# EasyEDA Pro project Controller Board DS-PI.epro, board PCB1
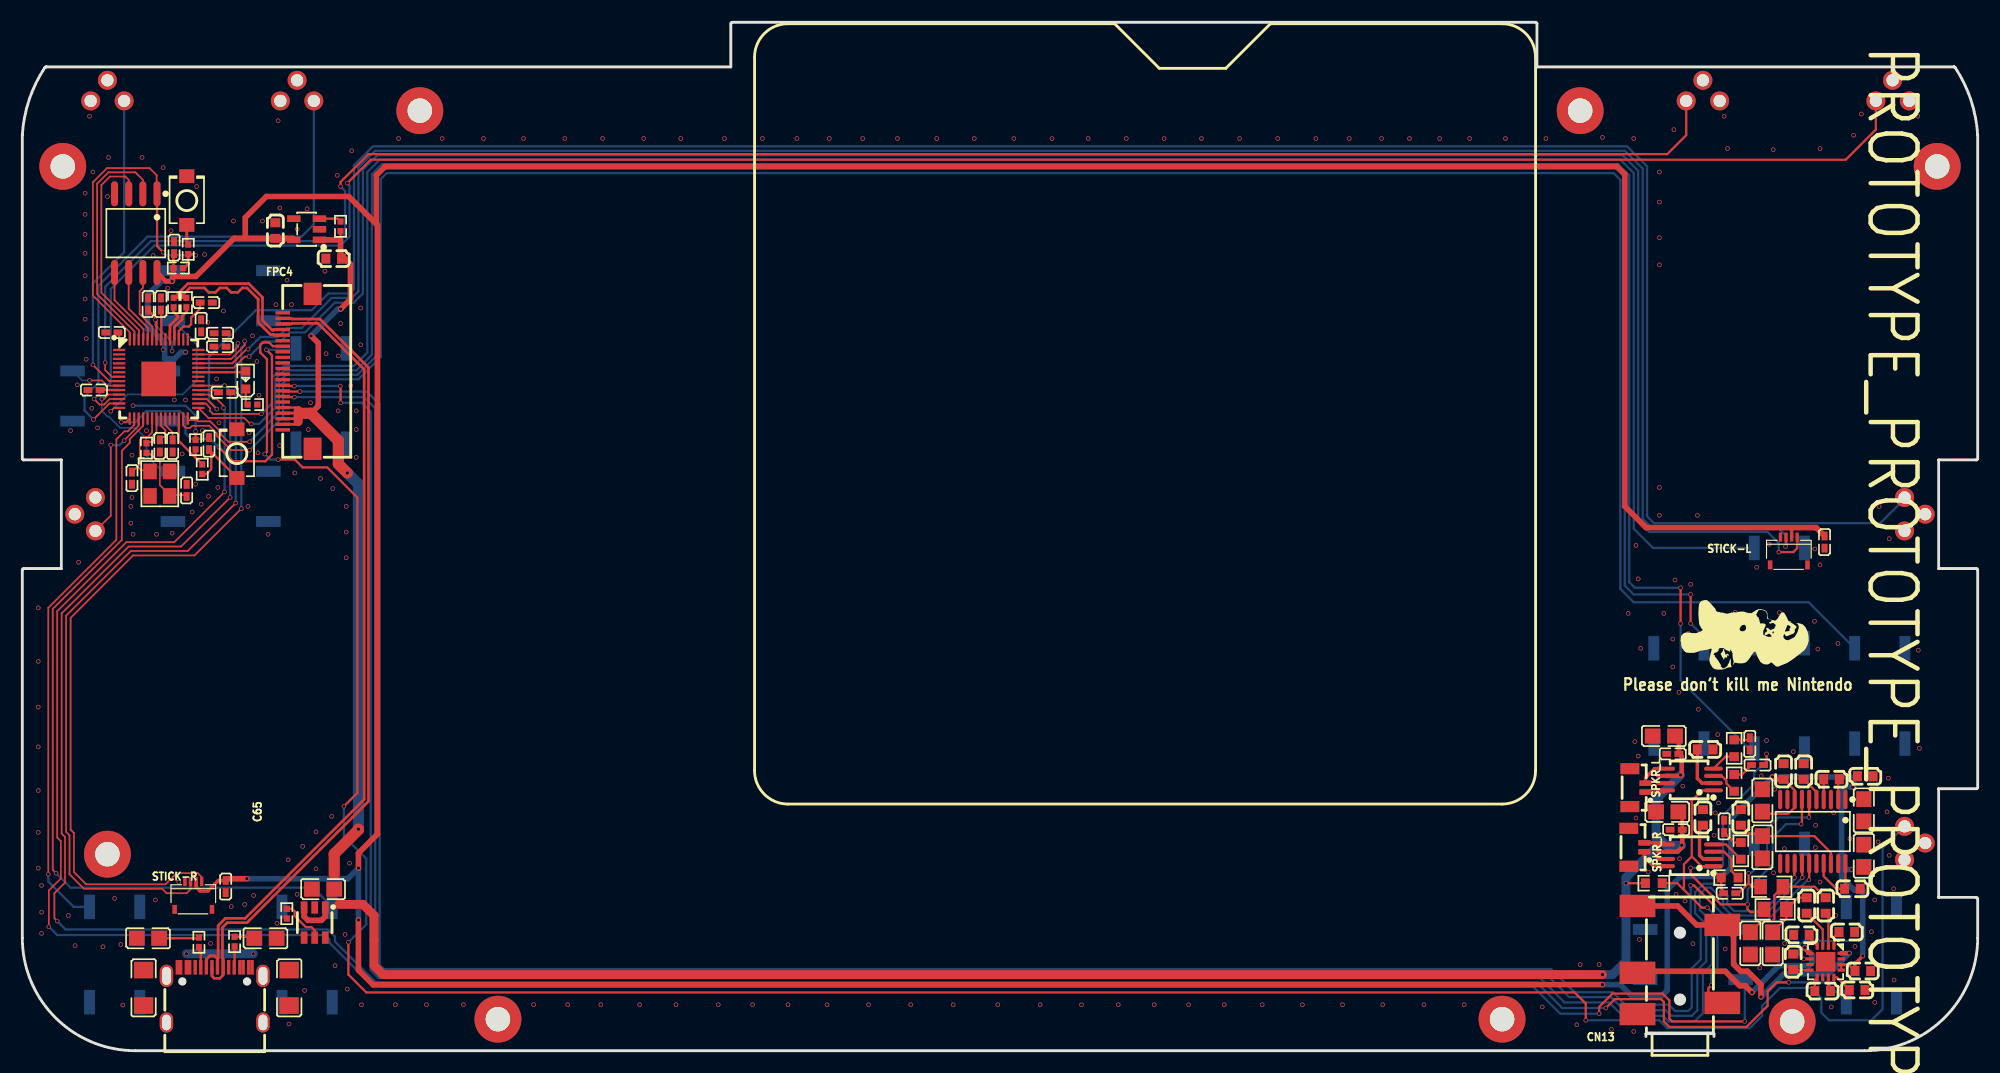
[diagram p1: board, top side]
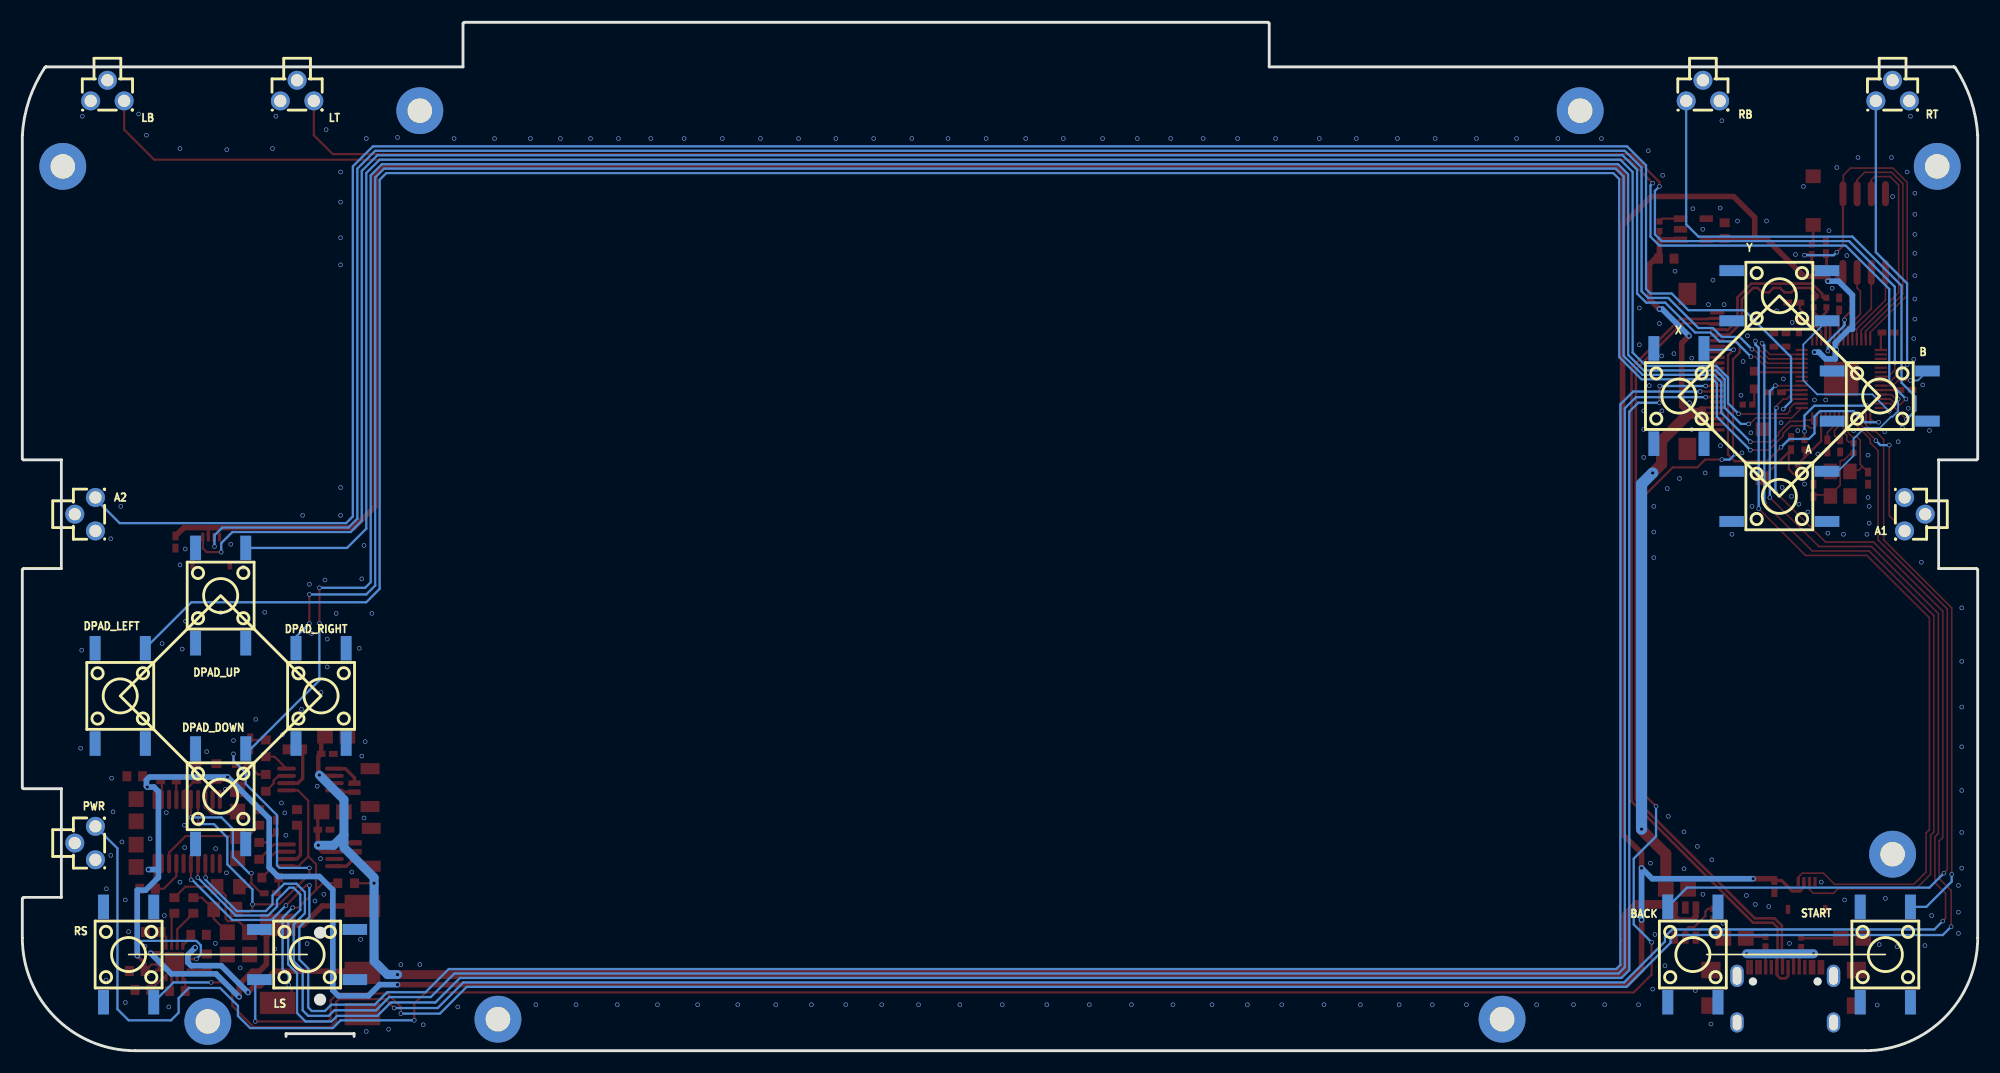
[diagram p2: board, bottom side, seen from below]

Outline 175.25 x 92.25 mm; copper layers: Top Layer, Inner1, Inner2, Bottom Layer. Coordinates in mm from the lower left corner of the outline.
Outline path: 0,82.13 arc(0,82.13) 0,82.13 0,53.13 arc(0.04,53.04) 0.13,53 3.5,53 3.5,43.25 0.13,43.25 arc(0.04,43.22) 0,43.13 0,10.13 arc(2.97,2.97) 10.13,0 165.13,0 arc(172.29,2.97) 175.25,10.13 175.25,13.63 arc(175.22,13.72) 175.13,13.75 171.75,13.75 171.75,23.5 175.13,23.5 arc(175.22,23.54) 175.25,23.63 175.25,43.13 arc(175.22,43.22) 175.13,43.25 171.75,43.25 171.75,53 175.13,53 arc(175.22,53.04) 175.25,53.13 175.25,82.13 arc(175.25,82.13) 175.25,82.13 arc(174.64,85.29) 173.24,88.19 arc(173.2,88.23) 173.16,88.25 arc(173.14,88.25) 173.13,88.25 arc(173.12,88.25) 173.12,88.25 135.75,88.25 135.75,92.13 arc(135.72,92.22) 135.63,92.25 63.63,92.25 arc(63.54,92.22) 63.5,92.13 63.5,88.25 2.14,88.25 arc(2.14,88.25) 2.14,88.25 arc(2.13,88.25) 2.13,88.25 arc(2.07,88.24) 2.02,88.2 arc(0.61,85.3) 0,82.13
Stack: Top Layer 0.035mm 外层铜厚1oz / Dielectric1 0.2104mm 7628 RC49% 8.6mil / Inner1 0.0152mm 内层铜厚 / Dielectric2 1.065mm 1.1mm H/HOZ 含铜 / Inner2 0.0152mm 内层铜厚 / Dielectric3 0.2104mm 7628 RC49% 8.6mil / Bottom Layer 0.035mm 外层铜厚1oz

## Design rules (mm)
net USB3-0-D_N: usb2-2
net USB3-0-D_P: usb2-2
net $1N5239: DP1
net $1N5220: DP1
net USB2_P: USB2
net USB2_N: USB2
template: Custom Config
spacing copperThickness1oz (default): track to track 0.102, other pairs 0.152 to 0.3
spacing copperThickness2oz: track to track 0.203, other pairs 0.152 to 0.3
track width copperThickness1oz (default): min 0.127, default 0.254, max 2.54
track width copperThickness2oz: min 0.203, default 0.254, max 2.54
differential pair differentialPair (default): width min 0.127, default 0.254, max 2.54; gap min 0.152, default 0.152
differential pair USB2: width min 0.239, default 0.239, max 0.239; gap min 0.15, default 0.15
via viaSize (default): diameter min 0.3, default 0.61, max 10; hole min 0.2, default 0.305, max 6.3
net USB3-0-D_N uses USB2
net USB3-0-D_P uses USB2
net $1N5239 uses USB2
net $1N5220 uses USB2
net USB2_P uses USB2
net USB2_N uses USB2
diff pair usb2-2 uses USB2
diff pair DP1 uses USB2
diff pair USB2 uses USB2
pour e541 uses copperRegion1
pour e557 uses copperRegion1
pour e573 uses copperRegion1
pour e584 uses copperRegion1
pour e1096 uses copperRegion1
pour e1109 uses copperRegion1
pour e1789 uses copperRegion1
pour e1821 uses copperRegion1
pour e544 uses copperRegion1
pour e794 uses copperRegion1
pour e1250 uses copperRegion1
pour e1608 uses copperRegion1
pour e1678 uses copperRegion1

## Placement (name value [footprint] x y rotation side)
A  K2-1102SP-C4SC-04  [KEY-SMD_4P-L6.0-W6.0-P4.50-LS9.5-BL]  17.78 49.73 270 bottom
A1  BX-TS-26-454543BSJ  [SW-TH_3P-L4.5-W4.3-P3.00-LS1.9]  5.63 48.13 90 bottom
A2  BX-TS-26-454543BSJ  [SW-TH_3P-L4.5-W4.3-P3.00-LS1.9]  169.63 48.13 270 bottom
B  K2-1102SP-C4SC-04  [KEY-SMD_4P-L6.0-W6.0-P4.50-LS9.5-BL]  8.78 58.73 270 bottom
BACK  K2-1102SP-C4SC-04  [KEY-SMD_4P-L6.0-W6.0-P4.50-LS9.5-BL]  25.53 8.63 180 bottom
BOOT1  TS-1088-AR02016  [SW-SMD_L3.9-W3.0-P4.45]  14.74 76.26 90 top
C2  33pF  [C0402]  9.83 51.36 90 top
C3  10uF  [C0805]  26.95 14.49 180 top
C5  10uF  [C0805]  11.27 10.09 180 top
C6  10uF  [C0805]  21.79 10.09 0 top
C7  100nF  [C0402]  16.48 67.11 180 top
C13  100nF  [C0402]  12.33 54.25 90 top
C14  100nF  [C0402]  16.03 65.03 270 top
C15  100nF  [C0402]  17.72 63.16 180 top
C16  100nF  [C0402]  18.13 59.06 180 top
C25  1uF  [C0603]  27.91 71.05 180 top
C33  1uF  [C0603]  22.68 73.57 90 top
C38  47uF  [C1206]  23.92 5.64 270 top
C39  47uF  [C1206]  10.87 5.64 270 top
C55  100nF  [C0402]  13.6 72.04 270 top
C56  1uF  [C0402]  17.73 64.36 0 top
C57  1uF  [C0402]  13.47 54.25 270 top
C58  100nF  [C0402]  11.28 66.98 270 top
C59  100nF  [C0402]  12.42 66.98 270 top
C60  100nF  [C0402]  8.03 64.43 0 top
C61  100nF  [C0402]  6.42 59.27 0 top
C62  33pF  [C0402]  14.73 50.26 270 top
C63  100nF  [C0402]  16.73 54.46 270 top
C64  100nF  [c0402]  161.53 45.63 270 top
C65  100nF  [c0402]  18.23 14.73 270 top
C70  2.2uF  [C0603]  162.15 24.35 180 top
C71  2.2uF  [C0603]  159.65 25.05 270 top
C72  10uF  [C0805]  165.05 21.57 90 top
C73  10uF  [C0805]  155.95 18.25 270 top
C74  10uF  [C0805]  155.95 22.45 270 top
C75  10uF  [C0805]  165.05 17.48 270 top
C76  100nF  [C0603]  164.03 14.53 180 top
C77  100nF  [C0603]  157.85 25.05 270 top
C78  100nF  [C0603]  165.18 24.62 180 top
C79  100nF  [C0603]  154.03 20.93 90 top
C80  2.2nF  [C0805]  154.88 9.63 270 top
C81  2.2nF  [C0805]  156.88 9.63 270 top
C82  1uF  [C0603]  161.63 13.03 90 top
C83  1uF  [C0603]  159.93 13.03 90 top
C84  1uF  [C0603]  163.53 10.65 0 top
C85  1uF  [C0603]  159.46 10.39 180 top
C86  2.2uF  [C0603]  164.95 7.15 0 top
C87  1uF  [C0603]  164.45 5.45 0 top
C88  1uF  [C0603]  161.35 5.35 0 top
C89  1uF  [C0603]  158.72 7.98 270 top
C90  1uF  [C0603]  150.63 20.93 90 top
C91  100nF  [C0402]  153.03 14.13 180 top
C92  100nF  [C0402]  152.53 20.13 270 top
C93  1uF  [C0603]  150.83 27.03 0 top
C94  100nF  [C0402]  155.53 25.63 180 top
C95  100nF  [C0402]  154.83 27.53 90 top
C96  100nF  [C0402]  147.93 26.63 0 top
C97  10uF  [C0805]  147.13 28.23 0 top
C98  100nF  [C0402]  148.23 19.83 0 top
C99  10uF  [C0805]  147.43 21.43 0 top
CN13  PJ-327A 5JJ  [AUDIO-SMD_PJ-327A5JJ]  148.57 8.13 180 top
DPAD_DOWN  K2-1102SP-C4SC-04  [KEY-SMD_4P-L6.0-W6.0-P4.50-LS9.5-BL]  157.48 22.83 0 bottom
DPAD_LEFT  K2-1102SP-C4SC-04  [KEY-SMD_4P-L6.0-W6.0-P4.50-LS9.5-BL]  166.48 31.83 0 bottom
DPAD_RIGHT  K2-1102SP-C4SC-04  [KEY-SMD_4P-L6.0-W6.0-P4.50-LS9.5-BL]  148.48 31.83 180 bottom
DPAD_UP  K2-1102SP-C4SC-04  [KEY-SMD_4P-L6.0-W6.0-P4.50-LS9.5-BL]  157.48 40.83 0 bottom
FPC4  AFC01-S22FCA-00  [FPC-SMD_P0.5-22P_FGS-XJ-H2.0]  24.68 60.94 270 top
LB  BX-TS-26-454543BSJ  [SW-TH_3P-L4.5-W4.3-P3.00-LS1.9]  167.63 86.13 0 bottom
LED3  KT-0603R  [LED0603-RD]  20.03 60.16 90 top
LS  K2-1102SP-C4SC-04  [KEY-SMD_4P-L6.0-W6.0-P4.50-LS9.5-BL]  149.73 8.63 90 bottom
LT  BX-TS-26-454543BSJ  [SW-TH_3P-L4.5-W4.3-P3.00-LS1.9]  150.63 86.13 0 bottom
NOREF  -  [Pad_e975]  158.63 2.63 0 top
NOREF#2  -  [Pad_e1003]  7.63 17.63 0 top
NOREF#3  -  [Pad_e2166]  132.63 2.83 0 top
NOREF#4  -  [Pad_e2164]  35.63 84.33 0 top
NOREF#5  -  [Pad_e1001]  171.63 79.33 0 top
NOREF#6  -  [Pad_e2163]  139.63 84.33 0 top
NOREF#7  -  [Pad_e2165]  42.63 2.83 0 top
NOREF#8  -  [Pad_e1002]  3.63 79.33 0 top
PWR  BX-TS-26-454543BSJ  [SW-TH_3P-L4.5-W4.3-P3.00-LS1.9]  169.63 18.63 270 bottom
R2  15kΩ  [R0402]  23.7 12.29 270 top
R43  56kΩ  [R0402]  19.02 9.79 90 top
R44  56kΩ  [R0402]  15.83 9.73 90 top
R47  22Ω  [R0402]  13.56 67.11 270 top
R48  22Ω  [R0402]  14.7 67.11 90 top
R49  1kΩ  [R0402]  11.13 54.06 90 top
R50  1kΩ  [R0402]  16.13 52.16 90 top
R51  1kΩ  [R0402]  14.87 71.89 270 top
R52  10kΩ  [R0402]  15.53 54.36 270 top
R53  10kΩ  [R0402]  13.98 70.21 180 top
R54  1kΩ  [R0402]  20.63 57.96 180 top
R55  1kΩ  [R0402]  28.52 73.95 90 top
R56  470Ω  [R0805]  156.8 14.71 0 top
R57  470Ω  [R0805]  157.1 12.68 0 top
R58  4.7kΩ  [R0603]  146.23 15.03 0 top
R61  30kΩ  [R0603]  153.43 24.03 270 top
R62  30kΩ  [R0603]  153.43 27.13 270 top
R63  30kΩ  [R0603]  153.03 15.53 0 top
R64  30kΩ  [R0603]  154.03 17.93 270 top
RB  BX-TS-26-454543BSJ  [SW-TH_3P-L4.5-W4.3-P3.00-LS1.9]  24.63 86.13 0 bottom
RESET1  TS-1088-AR02016  [SW-SMD_L3.9-W3.0-P4.45]  19.23 53.56 90 top
RS  K2-1102SP-C4SC-04  [KEY-SMD_4P-L6.0-W6.0-P4.50-LS9.5-BL]  165.73 8.63 0 bottom
RT  BX-TS-26-454543BSJ  [SW-TH_3P-L4.5-W4.3-P3.00-LS1.9]  7.63 86.13 0 bottom
SPKR_L  BM02B-SURS-TF(LF)(SN)  [CONN-SMD_2P-P0.80_BM02B-SURS-TF-LF-SN]  144.68 18.25 270 top
SPKR_R  BM02B-SURS-TF(LF)(SN)  [CONN-SMD_2P-P0.80_BM02B-SURS-TF-LF-SN]  144.78 23.6 270 top
START  K2-1102SP-C4SC-04  [KEY-SMD_4P-L6.0-W6.0-P4.50-LS9.5-BL]  8.28 8.63 0 bottom
STICK-L  FH19C-4S-0.5SH(10)  [FPC-SMD_FH19C-4S-0.5SH]  158.33 44.83 0 top
STICK-R  FH19C-4S-0.5SH(10)  [FPC-SMD_FH19C-4S-0.5SH]  15.33 13.93 0 top
U1  AP22653W6-7  [SOT-23-6_L2.9-W1.6-P0.95-LS2.8-BR]  26.2 11.49 90 top
U16  RP2040  [LQFN-56_L7.0-W7.0-P0.4-EP]  12.23 60.26 0 top
U17  W25Q128JVSIQTR  [SOIC-8_L5.3-W5.3-P1.27-LS8.0-BL]  10.17 73.34 180 top
U18  TPSPX3819M5-L-3-3  [SOT-23-5_L3.0-W1.6-P0.95-LS2.8-BR]  25.48 73.69 0 top
U20  PCM5102APWR  [TSSOP-20_L6.5-W4.4-P0.65-LS6.4-BL]  160.48 19.66 180 top
U21  PAM8908JER  [QFN-16_L3.0-W3.0-P0.50-BL-EP1.7]  161.62 7.98 180 top
U22  NS4150B  [MSOP-8_L3.0-W3.0-P0.65-LS5.0-BL]  149.43 17.53 90 top
U23  NS4150B  [MSOP-8_L3.0-W3.0-P0.65-LS5.0-BL]  149.43 24.33 90 top
USBC2  TYPE-C-31-M-12  [USB-C_SMD-TYPE-C-31-M-12]  17.25 5.01 0 top
X  K2-1102SP-C4SC-04  [KEY-SMD_4P-L6.0-W6.0-P4.50-LS9.5-BL]  26.78 58.73 0 bottom
X1  12MHz  [OSC-SMD_4P-L3.2-W2.5-BL]  12.33 50.86 270 top
Y  K2-1102SP-C4SC-04  [KEY-SMD_4P-L6.0-W6.0-P4.50-LS9.5-BL]  17.78 67.73 90 bottom

## Footprints (pads in the part's own frame, mm; a bottom-side part is the same pattern mirrored in y, then rotated)
AUDIO-SMD_PJ-327A5JJ
  rect 3.2x2 smd: 1(3.8,4.85) 2(-3.8,3.85) 3(3.8,1.15) 4(-3.8,-3.15) 5(3.8,-4.85)
c0402
  rect 0.79x0.54 smd: 1(-0.545,0) 2(0.545,0)
C0402
  rect 0.79x0.54 smd: 1(-0.545,0) 2(0.545,0)
C0603
  rect 0.8x0.9 smd: 1(-0.7,0) 2(0.7,0)
C0805
  rect 1.41x1.35 smd: 1(-1,0) 2(1,0)
C1206
  rect 1.485x1.728 smd: 1(-1.593,0) 2(1.593,0)
CONN-SMD_2P-P0.80_BM02B-SURS-TF-LF-SN
  rect 0.5x1.1 smd: 1(0.4,0.7) 2(-0.4,0.7)
  rect 1x1.7 smd: 3(-1.7,-0.7) 4(1.7,-0.7)
FPC-SMD_FH19C-4S-0.5SH
  rect 0.3x0.8 smd: 1(-0.75,1.25) 2(-0.25,1.25) 3(0.25,1.25) 4(0.75,1.25)
  rect 0.4x0.8 smd: 5(1.675,-1.25) 6(-1.675,-1.25)
FPC-SMD_P0.5-22P_FGS-XJ-H2.0
  rect 0.3x1.3 smd: 1(-5.252,-1.338) 2(-4.752,-1.338) 3(-4.252,-1.338) 4(-3.752,-1.338) 5(-3.252,-1.338) 6(-2.752,-1.338) 7(-2.252,-1.338) 8(-1.752,-1.338) 9(-1.25,-1.339) 10(-0.752,-1.338) 11(-0.252,-1.338) 12(0.248,-1.338) 13(0.748,-1.338) 14(1.248,-1.338) 15(1.748,-1.338) 16(2.248,-1.338) 17(2.748,-1.338) 18(3.248,-1.338) 19(3.748,-1.338) 20(4.25,-1.339) 21(4.748,-1.338) 22(5.248,-1.338)
  rect 2x1.6 smd: 23(6.95,1.339) 24(-6.95,1.339)
KEY-SMD_4P-L6.0-W6.0-P4.50-LS9.5-BL
  rect 0.98x2.2 smd: 1(-2.25,-4.275) 2(-2.25,4.275) 3(2.25,-4.275) 4(2.25,4.275)
LED0603-RD
  rect 0.8x0.8 smd: 1(-0.799,0) 2(0.799,0)
LQFN-56_L7.0-W7.0-P0.4-EP
  rect 1.1x0.2 smd: 1(-3.55,2.6) 2(-3.55,2.2) 3(-3.55,1.8) 4(-3.55,1.4) 5(-3.55,1) 6(-3.55,0.6) 7(-3.55,0.2) 8(-3.55,-0.2) 9(-3.55,-0.6) 10(-3.55,-1) 11(-3.55,-1.4) 12(-3.55,-1.8) 13(-3.55,-2.2) 14(-3.55,-2.6) 29(3.55,-2.6) 30(3.55,-2.2) 31(3.55,-1.8) 32(3.55,-1.4) 33(3.55,-1) 34(3.55,-0.6) 35(3.55,-0.2) 36(3.55,0.2) 37(3.55,0.6) 38(3.55,1) 39(3.55,1.4) 40(3.55,1.8) 41(3.55,2.2) 42(3.55,2.6)
  rect 0.2x1.1 smd: 15(-2.6,-3.55) 16(-2.2,-3.55) 17(-1.8,-3.55) 18(-1.4,-3.55) 19(-1,-3.55) 20(-0.6,-3.55) 21(-0.2,-3.55) 22(0.2,-3.55) 23(0.6,-3.55) 24(1,-3.55) 25(1.4,-3.55) 26(1.8,-3.55) 27(2.2,-3.55) 28(2.6,-3.55) 43(2.6,3.55) 44(2.2,3.55) 45(1.8,3.55) 46(1.4,3.55) 47(1,3.55) 48(0.6,3.55) 49(0.2,3.55) 50(-0.2,3.55) 51(-0.6,3.55) 52(-1,3.55) 53(-1.4,3.55) 54(-1.8,3.55) 55(-2.2,3.55) 56(-2.6,3.55)
  rect 3.1x3.1 smd: 57(0,0)
MSOP-8_L3.0-W3.0-P0.65-LS5.0-BL
  oval 0.364x1.692 smd: 1(-0.975,-2.146) 2(-0.325,-2.146) 3(0.325,-2.146) 4(0.975,-2.146) 5(0.975,2.146) 6(0.325,2.146) 7(-0.325,2.146) 8(-0.975,2.146)
OSC-SMD_4P-L3.2-W2.5-BL
  rect 1.4x1.2 smd: 1(-1.1,-0.875) 2(1.1,-0.875) 3(1.1,0.875) 4(-1.1,0.875)
Pad_e975
  round 4.2 hole 2.2: 101(0,0)
Pad_e1001
  round 4.2 hole 2.2: 101(0,0)
Pad_e1002
  round 4.2 hole 2.2: 101(0,0)
Pad_e1003
  round 4.2 hole 2.2: 101(0,0)
Pad_e2163
  round 4.2 hole 2.2: 101(0,0)
Pad_e2164
  round 4.2 hole 2.2: 101(0,0)
Pad_e2165
  round 4.2 hole 2.2: 101(0,0)
Pad_e2166
  round 4.2 hole 2.2: 101(0,0)
QFN-16_L3.0-W3.0-P0.50-BL-EP1.7
  rect 0.28x0.665 smd: 1(-0.75,-1.407) 2(-0.25,-1.407) 3(0.25,-1.407) 4(0.75,-1.407) 9(0.75,1.407) 10(0.25,1.407) 11(-0.25,1.407) 12(-0.75,1.407)
  rect 0.665x0.28 smd: 5(1.407,-0.75) 6(1.407,-0.25) 7(1.407,0.25) 8(1.407,0.75) 13(-1.407,0.75) 14(-1.407,0.25) 15(-1.407,-0.25) 16(-1.407,-0.75)
  rect 1.75x1.75 smd: 17(0,0)
R0402
  rect 0.566x0.54 smd: 1(-0.433,0) 2(0.433,0)
R0603
  rect 0.806x0.864 smd: 1(-0.753,0) 2(0.753,0)
R0805
  rect 1.133x1.377 smd: 1(-1,0) 2(1,0)
SOIC-8_L5.3-W5.3-P1.27-LS8.0-BL
  oval 0.63x2.25 smd: 1(-1.905,-3.53) 2(-0.635,-3.53) 3(0.635,-3.53) 4(1.905,-3.53) 5(1.905,3.53) 6(0.635,3.53) 7(-0.635,3.53) 8(-1.905,3.53)
SOT-23-5_L3.0-W1.6-P0.95-LS2.8-BR
  rect 1.2x0.6 smd: 1(1.15,-0.95) 2(1.15,0) 3(1.15,0.95) 4(-1.15,0.95) 5(-1.15,-0.95)
SOT-23-6_L2.9-W1.6-P0.95-LS2.8-BR
  rect 1.1x0.6 smd: 1(1.35,-0.95) 2(1.35,0) 3(1.35,0.95) 4(-1.35,0.95) 5(-1.35,0) 6(-1.35,-0.95)
SW-SMD_L3.9-W3.0-P4.45
  rect 1.23x1.36 smd: 1(-2.185,0) 2(2.185,0)
SW-TH_3P-L4.5-W4.3-P3.00-LS1.9
  round 1.7 hole 1.1: 1(-1.5,0.925) 2(1.5,0.925) 3(0,-0.925)
TSSOP-20_L6.5-W4.4-P0.65-LS6.4-BL
  oval 0.364x1.742 smd: 1(-2.925,-2.871) 2(-2.275,-2.871) 3(-1.625,-2.871) 4(-0.975,-2.871) 5(-0.325,-2.871) 6(0.325,-2.871) 7(0.975,-2.871) 8(1.625,-2.871) 9(2.275,-2.871) 10(2.925,-2.871) 11(2.925,2.871) 12(2.275,2.871) 13(1.625,2.871) 14(0.975,2.871) 15(0.325,2.871) 16(-0.325,2.871) 17(-0.975,2.871) 18(-1.625,2.871) 19(-2.275,2.871) 20(-2.925,2.871)
USB-C_SMD-TYPE-C-31-M-12
  oval 1.2x2 hole 0.8x1.6: 0(-4.325,1.706) 1(4.325,1.706)
  oval 1.2x1.8 hole 0.8x1.4: 2(4.325,-2.474) 3(-4.325,-2.474)
  rect 0.3x1.3 smd: A1(-3.35,2.474) A4(-2.55,2.474) A5(-1.25,2.474) A6(-0.25,2.474) A7(0.25,2.474) A8(1.25,2.474) A9(2.55,2.474) A12(3.35,2.474) B1(3.05,2.474) B4(2.25,2.474) B5(1.75,2.474) B6(0.75,2.474) B7(-0.75,2.474) B8(-1.75,2.474) B9(-2.25,2.474) B12(-3.05,2.474)

## Nets
As in the schematic.

Pads without a net: A 1; A1 3; A2 3; B 1; BACK 1; DPAD_DOWN 2; DPAD_LEFT 2; DPAD_RIGHT 1; DPAD_UP 2; FPC4 23 24; LB 3; LS 1; LT 3; NOREF 101; NOREF#2 101; NOREF#3 101; NOREF#4 101; NOREF#5 101; NOREF#6 101; NOREF#7 101; NOREF#8 101; PWR 3; RB 3; RS 1; RT 3; SPKR_L 3 4; SPKR_R 3 4; START 2; STICK-L 5 6; STICK-R 5 6; U1 4; U16 2 3 4 5 6 24 25; U18 4; USBC2 A8 B8; X 2; X1 2 4; Y 2

## Via types
v1: diameter 0.4, hole 0.3, Top Layer to Bottom Layer, 370 vias

## Routing (per net, layer and track width the routed paths; a pad name or vN(x,y) marks a point on that pad's centre or on a via; arc(x,y) is an arc through that point)
+1V1: length 12.7
  Top Layer w0.15: U16.23 12.83,56.1 13.47,55.46 13.47,55
  Top Layer w0.2: U16.50 12.03,65.46 v1(11.93,65.56) 11.93,65.79 C58.2 ; C7.2 15.94,66.57 15.13,65.76 15.13,65.16 14.93,64.96 14.43,64.96 14.03,64.56 U16.45
  Bottom Layer w0.2: v1(11.93,65.56) 11.93,65.08 13.43,63.58 v1(13.43,62.76)
+3.3V: length 506.2
  Top Layer w0.15: 12.33,55 12.39,55.06 12.73,55.06 12.83,55.16 12.83,55.66 12.43,56.06 U16.22
  Top Layer w0.2: C16.2 17.38,59.26 U16.33 ; U20.20 163.4,14.53 162.58,14.53 161.45,15.65 U20.17 ; U16.1 8.68,64.32 C60.2 ; R52.1 v1(15.53,55.56) ; C77.2 158.85,23.35 U20.8 158.85,21.83 158.28,21.25 156.15,21.25 C74.2 ; C86.1 163.68,7.73 U21.14 U21.13 ; C61.2 8.67,59.27 U16.10 ; U21.6 v1(159.65,8.23) ; C59.2 12.46,66.4 12.46,63.79
  Top Layer w0.254: 13.6,71.4 13.55,71.35 R53.2 13.55,69.91
  Top Layer w0.3: C86.1 164.25,7.81 v1(164.95,8.51) ; STICK-L.3 158.58,46.91 158.6,46.93 ; STICK-R.3 15.58,14.68 15.93,14.33 16.63,14.33 17.57,15.27 C65.1
  Top Layer w0.4: U17.8 12.86,69.03 v1(13.43,69.03) ; 13.55,69.45 13.55,69.91
  Top Layer w0.5: 24.33,72.74 24.2,72.87 C33.1 19.98,72.87 ; C77.2 157.06,24.35 v1(156.85,24.55) ; v1(30.13,16.38) 30.13,17.73 31.83,19.43 31.83,74.06 ; 19.98,72.87 18.97,72.87 15.55,69.45 13.55,69.45 13.45,69.36 13.45,69.05 v1(13.43,69.03) ; 19.98,72.87 19.98,74.73 21.88,76.63 29.26,76.63 31.83,74.06 ; C64.1 160.77,46.93 145.53,46.93 143.63,48.83 143.63,78.63 142.93,79.33 32.53,79.33 31.73,78.53 31.73,74.16 31.83,74.06 ; C65.1 18.38,15.43 v1(20.13,15.43) ; v1(30.13,11.73) 30.13,7.23 31.43,5.93 v1(141.63,5.93)
  Bottom Layer w0.2: v1(159.65,8.23) 159.25,8.63 159.25,9.45 159.65,9.85 164.74,9.85 164.95,9.64 ; v1(9.93,57.86) 14.64,57.86 15.53,56.98 v1(15.53,55.56)
  Bottom Layer w0.5: v1(14.63,62.66) 14.23,62.66 13.63,62.06 12.76,62.06 12.76,63.49 11.53,64.72 11.23,64.72 11.23,67.78 12.47,69.03 v1(13.43,69.03) ; v1(141.63,5.93) 143.23,5.93 144.23,4.93 146.93,4.93 147.43,5.43 147.43,14.43 148.63,15.63 152.33,15.63 153.13,16.43 153.13,20.82 154.7,22.39 v1(156.85,24.55) 163.85,24.55 164.13,24.28 164.13,23.73 v1(164.05,23.65) 163.45,23.65 163.05,23.25 163.05,16.25 ; v1(164.95,8.51) 164.95,14.4 164.19,14.4 163.05,15.54 163.05,16.25 ; v1(30.13,11.73) v1(30.13,16.38) 29.17,15.43 v1(20.13,15.43) ; 163.05,16.25 v1(163.95,16.25)
  vias: v1(12.63,62.88)
+5V: length 230.6
  Top Layer w0.2: v1(143.73,15.03) R58.1 ; R55.1 28.52,72.76 28.5,72.74 ; FPC4.18 24.46,57.69 24.73,57.43
  Top Layer w0.239: 24.73,56.43 24.49,56.19 FPC4.21 ; FPC4.19 24.49,57.19 24.73,57.43 ; 24.73,56.93 24.49,56.69 FPC4.20
  Top Layer w0.3: 148.63,21.43 148.77,21.28 C98.2
  Top Layer w0.4: U23.6 148.65,24.65 148.73,24.73 148.73,26.37 C96.2 148.47,27.88 C97.2 ; C98.2 148.77,18.27 148.35,17.85 U22.6
  Top Layer w0.5: v1(28.53,66.53) 29.41,67.41 29.41,70.55 28.61,71.35 28.52,71.44 28.52,72.76 ; 25.87,57.18 26.53,57.83 26.53,63.48 v1(25.88,64.13) ; U1.3 25.25,12.04 25.61,11.69 26.8,11.69 27.16,12.04 U1.1 ; U18.1 28.5,72.74
  Top Layer w0.8: 24.73,56.43 24.73,57.43 ; v1(141.63,6.83) 32.33,6.83 31.53,7.63 31.53,12.13 30.53,13.13 28.38,13.13
  Top Layer w1: 27.95,15.84 27.95,17.66 30.13,19.83 v1(30.13,19.88) ; 25.13,57.18 25.87,57.18 28.33,54.73 28.33,52.63 v1(29.13,51.83)
  Bottom Layer w0.5: v1(28.53,66.53) 28.28,66.53 v1(25.88,64.13)
  Bottom Layer w0.8: v1(148.73,18.43) 147.34,18.43 146.43,19.34 ; 146.43,19.34 146.43,18.23 143.73,15.53 v1(143.73,15.03) 143.73,8.03 142.53,6.83 v1(141.63,6.83) ; 146.43,19.34 146.43,22.53 v1(148.63,24.73)
  Bottom Layer w1: v1(29.13,51.83) 30.13,50.83 v1(30.13,19.88)
GND:
  vias: v1(1.43,39.73) v1(1.43,34.93) v1(1.43,30.83) v1(1.43,27.26) v1(1.43,23.34) v1(1.43,19.58) v1(1.43,16.37) v1(1.73,14.83) v1(1.73,12.43) v1(1.73,10.53) v1(4.13,12.13) v1(4.33,55.63) v1(4.73,9.43) v1(4.93,59.73) v1(5.05,43.82) v1(5.63,76.93) v1(5.63,75.03) v1(5.63,73.23) v1(5.63,71.53) v1(5.63,69.52) v1(5.63,67.43) v1(5.63,65.63) v1(5.73,63.88) v1(5.73,62.03) v1(6.03,83.83) v1(6.23,57.63) v1(6.33,78.83) v1(6.75,55.87) v1(7.13,54.63) v1(7.23,9.33) v1(7.63,76.63) v1(7.73,80.13) v1(8.33,55.53) v1(8.28,13.66) v1(8.83,9.53) v1(9,4.09) v1(9.73,48.83) v1(9.73,47.33) v1(9.83,53.43) v1(9.83,49.63) v1(9.93,46.33) v1(10.73,80.13) v1(11.13,55.63) v1(11.73,71.33) v1(11.93,13.53) v1(12.03,46.33) v1(12.63,79.23) v1(13.04,68.4) v1(13.33,73.56) v1(13.43,46.43) v1(13.63,58.38) v1(14.03,15.13) v1(14.33,53.53) v1(14.63,58.38) v1(15.23,48.33) v1(15.53,50.83) v1(15.63,77.53) v1(16.03,49.03) v1(16.13,55.63) v1(16.33,71.43) v1(16.63,65.33) v1(16.68,49.73) v1(16.88,9.63) v1(17.41,60.26) v1(17.53,50.53) v1(17.63,56.33) v1(18.03,66.36) v1(18.73,12.93) v1(18.93,74.43) v1(19.93,13.13) v1(20.23,48.83) v1(20.33,55.43) v1(20.63,64.13) v1(20.73,13.93) v1(21.03,61.83) v1(21.13,53.63) v1(21.21,58.8) v1(21.53,74.43) v1(22.03,46.33) v1(22.73,66.93) v1(22.83,11.43) v1(22.93,83.43) v1(23.06,54.28) v1(23.08,75.59) v1(23.73,69.13) v1(23.83,17.13) v1(23.91,2.39) v1(24.13,66.93) v1(24.43,51.83) v1(24.63,73.69) v1(24.63,14.03) v1(25.13,18.33) v1(25.3,5.4) v1(25.53,75.53) v1(25.63,62.13) v1(25.63,55.73) v1(25.83,58.13) v1(26.33,19.63) v1(26.32,16.32) v1(26.73,51.33) v1(27.13,69.93) v1(27.23,62.53) v1(27.73,21.03) v1(27.83,50.43) v1(28.03,7.63) v1(28.23,78.53) v1(28.33,62.33) v1(28.3,57.4) v1(28.53,65.23) v1(28.93,10.43) v1(29.03,48.83) v1(29.03,46.53) v1(29.03,44.23) v1(29.13,5.53) v1(29.33,16.83) v1(29.44,59.66) v1(29.53,80.73) v1(29.93,57.4) v1(29.93,55.73) v1(29.93,53.23) v1(30.33,66.63) v1(30.33,63.33) v1(30.4,4.13) v1(33.43,4.13) v1(33.73,81.83) v1(36.23,4.13) v1(37.63,81.83) v1(39.53,4.13) v1(41.33,81.83) v1(44.93,81.83) v1(45.83,4.13) v1(48.63,81.83) v1(48.88,4.13) v1(51.85,4.13) v1(52.01,81.83) v1(55.33,4.13) v1(55.69,81.83) v1(58.59,4.13) v1(59.01,81.83) v1(62.37,4.13) v1(62.93,81.83) v1(65.45,4.13) v1(66.33,81.83) v1(68.63,4.13) v1(69.42,81.83) v1(72.13,4.13) v1(72.33,81.83) v1(75.33,81.83) v1(75.84,4.13) v1(78.43,81.83) v1(79.63,4.13) v1(81.95,81.83) v1(83.43,4.13) v1(85.32,81.83) v1(87.43,4.13) v1(88.87,81.83) v1(91.23,4.13) v1(92.29,81.83) v1(94.93,4.13) v1(95.53,81.83) v1(98.23,4.13) v1(98.95,81.83) v1(101.45,4.13) v1(102.34,81.83) v1(104.53,4.13) v1(105.68,81.83) v1(107.73,4.13) v1(109.1,81.83) v1(111.13,4.13) v1(112.52,81.83) v1(114.73,4.13) v1(115.94,81.83) v1(118.33,4.13) v1(118.93,81.83) v1(121.83,81.83) v1(121.93,4.13) v1(124.33,81.83) v1(125.63,4.13) v1(127.03,81.83) v1(129.23,4.13) v1(129.72,81.83) v1(132.93,81.83) v1(136.23,3.93) v1(136.56,81.83) v1(139.33,2.33) v1(139.63,7.73) v1(141.33,7.73) v1(141.63,81.93) v1(142.43,1.93) v1(143.93,39.23) v1(144.43,81.83) v1(144.43,1.73) v1(144.53,27.73) v1(144.63,45.33) v1(144.63,20.88) v1(144.83,42.33) v1(144.83,26.43) v1(144.93,9.98) v1(145.05,36.1) v1(145.73,16.03) v1(146.73,78.83) v1(146.73,76.13) v1(146.73,72.93) v1(146.73,70.49) v1(146.73,50.53) v1(146.73,48.03) v1(147.13,39.23) v1(147.93,36.93) v1(147.93,34.43) v1(148.03,82.63) v1(148.13,42.23) v1(148.23,14.03) v1(148.48,32.14) v1(148.53,17.23) v1(148.83,23.73) v1(149.03,13.43) v1(149.33,37.43) v1(149.53,41.84) v1(149.73,9.6) v1(150.13,48.03) v1(150.23,30.63) v1(151.63,19.33) v1(151.73,21.33) v1(151.95,28.35) v1(152.03,22.23) v1(152.53,83.83) v1(152.63,9.13) v1(152.83,80.93) v1(153.53,39.33) v1(154.33,29.73) v1(155.44,43.37) v1(155.73,7.43) v1(155.85,24.65) v1(156.33,27.83) v1(156.57,45.43) v1(156.93,80.83) v1(156.95,15.95) v1(157.05,23.45) v1(157.48,39.3) v1(157.93,18.13) v1(157.96,9.63) v1(158.73,26.83) v1(160.66,45.01) v1(160.63,38.53) v1(160.73,20.23) v1(160.71,18.22) v1(160.93,36.03) v1(161.13,80.93) v1(161.12,43.58) v1(161.13,15.13) v1(162.13,3.93) v1(162.35,21.35) v1(162.53,12.13) v1(162.73,36.53) v1(163.8,19.02) v1(164.13,82.13) v1(164.25,9.35) v1(164.83,84.03) v1(165.73,10.68) v1(166.03,13.53) v1(166.03,4.33) v1(166.33,18.73) v1(166.43,48.83) v1(167.13,21.43) v1(167.25,24.45) v1(167.33,45.93) v1(167.33,17.53) v1(167.73,14.53) v1(167.76,6.34) v1(169.88,83.83) v1(169.93,35.93) v1(170.03,27.13)
VBUS: length 11.4
  Top Layer w0.2: C5.1 15.75,10.09 R44.2 ; C6.1 20.66,10.22 R43.2
  Bottom Layer w0.8: v1(14.7,8.69) v1(20.7,8.69)
A1: length 12.2
  Top Layer w0.15: v1(9.13,54.73) 9.13,54.76 10.43,56.06 U16.17 ; v1(7.93,54.33) 7.93,48 A1.1
  Bottom Layer w0.2: v1(7.93,54.33) 8.73,54.33 v1(9.13,54.73)
A2: length 206.7
  Top Layer w0.15: v1(17.43,57.56) 16.53,58.46 U16.31
  Bottom Layer w0.2: A2.1 168.7,49.5 166.53,47.33 146.23,47.33 145.63,47.93 145.63,79.33 143.83,81.13 31.43,81.13 29.73,79.43 29.73,68.33 29.33,67.93 27.43,67.93 25.93,66.43 20.93,66.43 16.73,62.23 16.73,58.26 v1(17.43,57.56)
AMP_SW: length 27.1
  Top Layer w0.2: v1(151.38,5.88) 151.12,5.62 151.12,4.28 ; R58.2 148.33,15.03 148.93,14.43 ; 148.93,14.43 148.93,16.73 149.63,17.43 ; 148.93,14.43 150.53,12.83 v1(151.03,12.83) ; U23.1 150.55,23.35 149.63,22.43 149.63,17.43 ; 149.63,17.43 150.5,16.55 U22.1
  Bottom Layer w0.2: v1(151.38,5.88) 151.38,6.78 151.93,7.33 151.93,11.93 v1(151.03,12.83)
BCK: length 204.1
  Top Layer w0.2: v1(158.83,15.53) 158.83,16.77 U20.13 ; v1(24.38,58.63) 23.41,58.63 FPC4.16
  Bottom Layer w0.2: v1(24.38,58.63) 30.63,58.63 31.63,57.63 31.63,7.49 32.19,6.93 136.53,6.93 138.64,4.81 142.36,4.81 143.55,3.63 147.29,3.63 147.79,3.13 149.63,3.13 150.13,3.63 150.13,7.23 150.93,8.03 150.93,11.33 149.93,12.33 149.93,14.23 150.68,14.98 151.78,14.98 152.83,13.93 152.83,13.13 153.43,12.53 156.03,12.53 158.83,15.33 v1(158.83,15.53)
DACL: length 14.2
  Top Layer w0.2: C91.1 153.83,14.13 154.73,15.03 ; 160.15,22.53 160.15,20.95 v1(160.13,20.93) ; 154.73,15.03 155.04,14.71 R56.1 ; 154.73,15.03 v1(154.73,15.93)
  Bottom Layer w0.2: v1(154.73,15.93) 154.93,15.93 156.38,17.38 156.38,19.89 157.41,20.93 v1(160.13,20.93)
DACR: length 36.8
  Top Layer w0.2: v1(156.33,26.63) 156.33,25.88 C94.1 ; v1(149.53,16.4) 149.53,15.83 152.23,13.13 v1(154.63,13.13) 154.63,12.7 154.9,12.43 155.85,12.43 R57.1 ; v1(159.43,20.33) 159.5,20.4 159.5,22.53
  Bottom Layer w0.2: v1(154.63,13.13) 154.63,14.47 156.88,16.72 156.88,19.13 158.08,20.33 v1(159.43,20.33) ; v1(156.33,26.63) 156.33,26.03 155.23,24.93 155.23,23.93 152.43,21.13 152.43,16.63 152.2,16.4 v1(149.53,16.4)
DIN: length 206.4
  Top Layer w0.2: v1(159.53,15.53) 159.53,16.77 159.5,16.79 ; v1(24.38,59.63) 23.41,59.63 FPC4.14 ; v1(28.5,59.63) 28.53,59.6 v1(28.53,58.13)
  Bottom Layer w0.2: v1(28.53,58.13) 30.43,58.13 31.23,57.33 31.23,7.23 31.93,6.53 136.03,6.53 138.23,4.33 142.23,4.33 143.43,3.13 147.04,3.13 147.54,2.63 149.88,2.63 150.63,3.38 150.63,6.95 151.43,7.75 151.43,11.54 150.34,12.63 150.34,14.01 150.95,14.63 151.33,14.63 152.43,13.53 152.43,12.93 153.23,12.13 156.13,12.13 v1(159.53,15.53) ; v1(24.38,59.63) v1(28.5,59.63)
DOWN: length 208.7
  Top Layer w0.15: v1(20.53,56.23) 20.43,56.23 19.89,56.76 16.68,56.76 U16.29
  Top Layer w0.2: v1(148.63,38.33) v1(148.63,41.53)
  Bottom Layer w0.2: DPAD_DOWN.1 154.75,27.1 148.63,33.23 v1(148.63,38.33) ; v1(20.53,56.23) 21.23,56.23 22.68,57.68 22.68,60.25 23.45,61.03 29.93,61.03 31.33,62.42 31.33,78.63 32.23,79.53 143.03,79.53 144.03,78.53 144.03,42.03 144.53,41.53 v1(148.63,41.53)
J1-X: length 192.5
  Top Layer w0.15: U16.38 18.93,61.26 19.93,62.26 v1(20.33,62.26)
  Top Layer w0.2: STICK-L.4 159.08,45.08 158.73,44.73 v1(157.43,44.73)
  Bottom Layer w0.2: v1(157.43,44.73) 157.43,45.52 156.42,46.53 145.83,46.53 144.83,47.53 144.83,78.93 143.43,80.33 31.83,80.33 30.53,79.03 30.53,67.93 29.7,67.1 28,67.1 25.33,64.43 23.94,64.43 23.14,63.63 21.69,63.63 v1(20.33,62.26)
J1-Y: length 191.2
  Top Layer w0.15: U16.39 18.83,61.66 20.09,62.93 v1(20.23,62.93)
  Top Layer w0.2: STICK-L.2 158.08,45.28 v1(158.03,45.23)
  Bottom Layer w0.2: v1(20.23,62.93) 21.33,64.03 22.93,64.03 23.73,64.83 25.03,64.83 27.73,67.53 29.53,67.53 30.13,68.13 30.13,79.23 31.63,80.73 143.63,80.73 145.23,79.13 145.23,47.73 146.03,46.93 157.33,46.93 158.03,46.23 v1(158.03,45.23)
J2-X: length 75.4
  Top Layer w0.15: STICK-R.4 16.08,15.58 15.73,15.93 13.83,15.93 12.83,14.93 5.73,14.93 4.63,16.03 4.63,19.53 4.33,19.83 4.33,38.83 9.93,44.43 15.43,44.43 v1(19.63,48.63) ; U16.40 18.73,62.06 19.93,63.26 v1(19.93,63.66)
  Bottom Layer w0.2: v1(19.63,48.63) 19.63,63.06 19.93,63.36 v1(19.93,63.66)
J2-Y: length 73.7
  Top Layer w0.15: U16.41 18.63,62.46 19.33,63.16 v1(19.33,63.46) ; STICK-R.2 15.08,14.48 14.73,14.13 12.93,14.13 12.53,14.53 5.53,14.53 4.23,15.83 4.23,19.33 3.93,19.63 3.93,39.03 9.73,44.83 14.83,44.83 v1(19.13,49.13)
  Bottom Layer w0.2: v1(19.33,63.46) 19.13,63.26 v1(19.13,49.13)
K1: length 12.3
  Top Layer w0.15: v1(7.13,58.46) 7.33,58.46 7.73,58.86 U16.11
  Bottom Layer w0.15: v1(7.13,58.46) 7.13,57.38 7.63,56.88 7.76,56.88 8.76,55.88 10.13,55.88 11.13,54.88 11.13,53.38 12.53,51.98 A.2
K2: length 4.7
  Top Layer w0.15: v1(6.03,60.13) 7.13,60.13 7.59,59.66 U16.9
  Bottom Layer w0.15: B.2 5.35,60.13 v1(6.03,60.13)
K3: length 27.8
  Top Layer w0.15: v1(6.33,61.53) 7.79,60.06 U16.8
  Bottom Layer w0.2: RT.2 9.13,71.63 6.33,68.83 v1(6.33,61.53)
K4: length 162.7
  Top Layer w0.15: v1(7.43,61.73) 7.43,61.06 8.03,60.46 U16.7
  Top Layer w0.2: LT.1 149.13,82.13 147.43,80.43 31.03,80.43 28.53,77.93 v1(28.53,77.53)
  Bottom Layer w0.2: v1(28.53,77.53) 28.93,77.13 28.93,73.23 28.33,72.63 11.53,72.63 7.43,68.53 v1(7.43,61.73)
L3: length 221.1
  Top Layer w0.15: U16.32 16.7,58.86 17.11,58.46 17.43,58.46 18.03,57.86 v1(18.03,57.66) ; v1(2.38,11.13) 2.38,14.38 3.45,15.45 3.45,18.8 3.13,19.13 3.13,39.43 9.33,45.63 13.63,45.63 v1(18.13,50.13)
  Top Layer w0.2: v1(141.33,3.33) 141.33,3.93 142.53,5.13 147.01,5.13 147.62,4.51 147.62,2.88 147.88,2.63 v1(154.38,2.63)
  Bottom Layer w0.2: v1(154.38,2.63) 154.38,6 LS.2 ; v1(18.03,57.66) 18.13,57.56 v1(18.13,50.13) ; v1(141.33,3.33) 137.83,3.33 135.43,5.73 31.48,5.73 27.53,9.68 27.53,9.96 27.11,10.38 3.13,10.38 v1(2.38,11.13)
L+: length 2.7
  Top Layer w0.3: U22.8 146.2,16.55 145.38,17.37 SPKR_L.1
L-: length 2
  Top Layer w0.3: U22.5 147.14,18.65 SPKR_L.2
LEFT: length 212.2
  Top Layer w0.15: v1(20.38,53.88) 18.71,53.88 17.43,55.16 17.43,55.37 16.74,56.06 15.23,56.06 15.03,55.86 14.65,55.86 14.43,56.09 U16.27
  Bottom Layer w0.2: DPAD_LEFT.1 160.1,40.23 144.43,40.23 143.23,41.43 143.23,78.13 142.63,78.73 32.66,78.73 32.13,78.19 32.13,62.23 30.13,60.23 23.73,60.23 23.38,59.88 23.38,56.88 v1(20.38,53.88)
LRCK: length 205.5
  Top Layer w0.2: v1(151.63,13.03) 149.83,14.83 v1(149.53,14.83) ; 23.31,59.23 FPC4.15 23.41,59.13 v1(24.88,59.13) ; 160.15,16.79 160.15,15.35 v1(160.13,15.33)
  Bottom Layer w0.2: v1(149.53,14.83) 149.53,11.98 150.43,11.08 150.43,8.18 149.63,7.38 149.63,3.88 149.31,3.56 148.12,3.56 147.56,4.13 143.67,4.13 142.55,5.24 139.11,5.24 137.03,7.33 32.39,7.33 32.03,7.69 32.03,57.98 30.88,59.13 v1(24.88,59.13) ; v1(160.13,15.33) 160.03,15.33 156.43,11.73 152.93,11.73 v1(151.63,13.03)
P1: length 30.1
  Top Layer w0.15: v1(8.88,56.38) 9.29,56.38 U16.15
  Top Layer w0.2: v1(17.63,54.13) 18.88,52.88 21.78,52.88 22.38,53.48 22.38,62.38 v1(21.88,62.88)
  Bottom Layer w0.2: v1(21.88,62.88) 24.4,62.88 X.1 ; v1(17.63,54.13) 16.88,54.88 15.13,54.88 14.63,55.38 14.63,56.88 14.13,57.38 11.13,57.38 10.13,56.38 v1(8.88,56.38)
P2: length 16
  Top Layer w0.15: U16.14 8.23,57.66 v1(7.93,57.36)
  Bottom Layer w0.15: v1(7.93,57.36) 9.44,58.88 14.38,58.88 15.63,60.13 15.63,63.35 Y.1
P3: length 48.4
  Top Layer w0.15: U16.13 7.81,58.06 v1(6.38,56.63)
  Bottom Layer w0.2: v1(6.38,56.63) 5.58,57.43 5.58,58.68 6.83,59.93 6.83,68.63 11.23,73.03 25.03,73.03 26.13,74.13 RB.2
P4: length 182.9
  Top Layer w0.15: v1(6.43,58.46) 6.93,57.96 7.33,57.96 7.83,58.46 U16.12
  Top Layer w0.2: v1(29.13,77.83) 31.23,79.93 163.43,79.93 166.13,82.63 LB.1
  Bottom Layer w0.2: v1(6.43,58.46) 7.93,59.96 7.93,68.33 11.83,72.23 28.53,72.23 29.33,73.03 29.33,77.63 v1(29.13,77.83)
PWR_BUTTON: length 229.1
  Top Layer w0.2: v1(28.83,21.93) 30.03,23.13 30.03,49.63 27.33,52.33 25.13,52.33 24.43,53.03 v1(22.93,53.03) ; FPC4.7 22.46,63.19 22.13,63.53 21.53,63.53 21.33,63.33 21.33,62.63 21.93,62.03 21.93,53.73 v1(21.73,53.53) ; v1(29.23,9.73) 29.23,6.83 30.83,5.23 139.13,5.23 140.13,4.23 v1(140.13,2.73)
  Bottom Layer w0.2: PWR.1 166.73,18.15 166.73,3.73 165.73,2.73 161.93,2.73 161.24,3.41 161.24,4.71 160.33,5.63 157.53,5.63 155.93,4.03 155.93,3.13 154.83,2.03 147.43,2.03 146.73,2.73 v1(140.13,2.73) ; v1(29.23,9.73) 30.83,11.33 30.83,17.23 28.83,19.23 v1(28.83,21.93) ; v1(21.73,53.53) 22.23,53.03 v1(22.93,53.03)
QSPI_SCLK: length 6.7
  Top Layer w0.15: 11.26,63.79 11.26,64.84 9.54,66.57 U17.6
QSPI_SD0: length 7.1
  Top Layer w0.15: 10.86,63.79 10.86,64.74 8.27,67.33 U17.5
QSPI_SD1: length 21.4
  Top Layer w0.15: U17.2 10.81,78.12 10.13,78.79 7.72,78.79 6.7,77.78 6.7,67.87 10.06,64.52 10.06,63.79
QSPI_SD2: length 19.4
  Top Layer w0.15: U17.3 9.54,78.12 9.24,78.41 7.85,78.41 7.08,77.65 7.08,68 10.46,64.63 10.46,63.79
QSPI_SD3: length 6.6
  Top Layer w0.15: 11.66,63.79 11.66,64.95 10.51,66.09 10.51,68.13 10.81,68.42 U17.7
QSPI_SS: length 34.4
  Top Layer w0.15: 9.66,63.79 9.66,64.41 6.32,67.75 6.32,77.91 7.59,79.18 11.4,79.18 12.04,78.54 12.04,76.91 U17.1
  Top Layer w0.2: R51.2 15.43,71.46 v1(15.53,71.36) ; U17.1 12.08,72.18 v1(12.63,71.63)
  Top Layer w0.254: R51.2 14.87,70.57 14.41,70.11
  Bottom Layer w0.2: v1(15.53,71.36) 12.89,71.36 v1(12.63,71.63)
R3: length 229.6
  Top Layer w0.15: v1(18.13,59.66) U16.34 ; v1(3.13,11.63) 2.88,11.88 2.88,14.13 3.83,15.08 3.83,19.18 3.53,19.48 3.53,39.23 9.53,45.23 14.23,45.23 v1(18.63,49.63)
  Top Layer w0.2: v1(158.33,6.13) 157.23,6.13 156.43,5.33 156.43,4.03 154.53,2.13 147.63,2.13 147.13,2.63 147.13,4.38 146.88,4.63 142.73,4.63 v1(141.93,3.83)
  Bottom Layer w0.2: v1(18.13,59.66) 18.63,59.16 v1(18.63,49.63) ; v1(141.93,3.83) 138.03,3.83 135.73,6.13 31.69,6.13 28.03,9.79 28.03,10.23 27.38,10.88 3.88,10.88 v1(3.13,11.63) ; RS.2 161.7,6.13 v1(158.33,6.13)
R+: length 1.9
  Top Layer w0.3: U23.8 147.13,23.2 SPKR_R.1
R-: length 2.6
  Top Layer w0.3: SPKR_R.2 145.48,24.48 146.3,25.3 U23.5
RIGHT: length 199.5
  Top Layer w0.15: U16.28 14.98,56.56 15.63,56.56 15.73,56.46 16.84,56.46 17.83,55.47 17.83,55.26 18.46,54.63 v1(20.38,54.63)
  Top Layer w0.2: v1(149.53,38.33) v1(149.53,40.93)
  Bottom Layer w0.2: DPAD_RIGHT.2 150.73,37.13 v1(149.53,38.33) ; v1(149.53,40.93) 144.43,40.93 143.63,41.73 143.63,78.33 142.83,79.13 32.43,79.13 31.73,78.43 31.73,62.33 30.03,60.63 23.63,60.63 22.98,59.98 22.98,57.23 v1(20.38,54.63)
S1: length 70.3
  Top Layer w0.15: v1(3.03,15.93) 2.73,16.23 2.73,39.63 8.93,45.83 8.93,53.83 9.63,54.53 9.63,54.86 10.83,56.06 U16.18
  Bottom Layer w0.2: BACK.2 26.05,14.63 4.33,14.63 v1(3.03,15.93)
S2: length 49.5
  Top Layer w0.15: v1(2.33,15.83) 2.33,39.73 8.43,45.83 8.43,54.83 9.16,55.56 9.45,55.56 10.03,56.14 U16.16
  Bottom Layer w0.2: v1(2.33,15.83) 2.33,15.18 4.6,12.9 START.1
UP: length 193.4
  Top Layer w0.15: U16.30 16.43,58.06 16.83,57.66 16.83,57.38 17.08,57.13 v1(21.43,57.13)
  Bottom Layer w0.2: v1(21.43,57.13) 22.38,58.08 22.38,60.38 23.43,61.43 29.73,61.43 30.93,62.63 30.93,78.83 32.03,79.93 143.23,79.93 144.43,78.73 144.43,46.83 146.15,45.1 DPAD_UP.1
USB2_N: length 13.5
  Top Layer w0.239: R48.2 14.41,67.54 14.33,67.63 14.33,67.75 15.01,68.43 16.32,68.43 16.72,68.03 17.32,68.03 17.72,68.43 18.32,68.43 18.72,68.03 19.32,68.03 19.72,68.43 20.13,68.43 21.14,67.42 21.14,65.35 22.24,64.25 22.52,64.25 22.57,64.19 FPC4.5
USB2_P: length 13.4
  Top Layer w0.239: R47.1 13.85,67.54 13.94,67.63 13.94,67.91 14.85,68.82 20.29,68.82 21.53,67.58 21.53,65.51 22.4,64.64 22.52,64.64 22.57,64.69 FPC4.4
USB3-0-D_N: length 71.9
  Top Layer w0.239: FPC4.3 24.11,65.19 24.17,65.25 26.5,65.25 30.64,61.12 30.64,22.54 19.98,11.88 18.21,11.88 17.55,11.22 17.55,8.31 17.5,8.25 USBC2.A7 17.49,7.48 17.49,7.48 17.49,8.26 17.23,8.52 16.83,8.52 16.5,8.18 USBC2.B7
USB3-0-D_P: length 72.5
  Top Layer w0.239: FPC4.2 24.11,65.69 24.17,65.64 26.67,65.64 31.03,61.28 31.03,22.38 20.14,11.49 18.37,11.49 17.94,11.06 17.94,8.31 18,8.25 USBC2.B6 18,6.78 17.7,6.49 17.2,6.49 17,6.7 USBC2.A6
XIN: length 7.1
  Top Layer w0.15: 10.33,52.41 10.53,52.61 10.53,54.77 10.82,55.06 11.23,55.06 11.63,55.46 U16.20 ; 10.33,52.41 C2.2 ; 10.33,52.41 10.67,52.06 11.45,52.06
XOUT: length 2.9
  Top Layer w0.15: U16.21 12.03,55.48 11.73,55.19 11.73,54.77 11.56,54.59 10.93,54.59
$1N5125: length 1.9
  Top Layer w0.2: R43.1 19.02,7.51 USBC2.B5
$1N5126: length 1.9
  Top Layer w0.2: USBC2.A5 16,8.83 15.83,8.99 R44.1
$1N5147: length 4.2
  Top Layer w0.2: U1.5 26.2,10.79 25.91,11.09 25.41,11.09 24.41,12.09 24.41,12.49 24.17,12.73 R2.1
$1N5203: length 1.5
  Top Layer w0.2: 20.03,57.89 LED3.1
$1N5210: length 6.6
  Top Layer w0.15: 11.03,53.73 11.23,53.73 12.01,52.96 12.23,52.96 12.33,52.86 12.33,50.74 13.2,49.86 14.58,49.86 C62.2
$1N5217: length 2
  Top Layer w0.254: R51.1 14.74,72.45 14.74,74.28
$1N5218: length 5.7
  Top Layer w0.2: 15.53,53.19 14.03,54.69 U16.26 ; 15.53,53.19 16.13,52.59 ; 15.53,53.19 R52.2
$1N5219: length 4.3
  Top Layer w0.2: U16.37 19.73,60.86 19.83,60.96 LED3.2
$1N5220: length 3.3
  Top Layer w0.239: R47.2 13.56,66.28 13.94,65.9 13.94,65.78 13.23,65.07 13.23,64.49 13.23,64.48 U16.47
$1N5221: length 6.1
  Top Layer w0.2: 16.13,51.73 16.5,51.73 16.93,52.16 16.93,53.72 ; 16.93,53.72 C63.2 ; 16.93,53.72 19.23,51.42 19.23,51.38
$1N5239: length 3.3
  Top Layer w0.239: U16.46 13.63,64.48 13.62,64.49 13.62,64.91 14.33,65.62 14.33,65.9 14.71,66.28 14.71,66.68
$1N5319: length 2
  Top Layer w0.2: U18.3 28.27,74.64 R55.2
$1N5344: length 1.8
  Top Layer w0.2: C70.2 161.45,22.54 U20.4
$1N5349: length 1.9
  Top Layer w0.2: C70.1 162.75,24.25 U20.2
$1N5350: length 2.3
  Top Layer w0.2: 160.8,22.53 160.8,23.2 C71.2
$1N5352: length 10
  Top Layer w0.2: U20.18 162.1,17.76 160.61,19.25 C73.1 ; C79.1 154.8,19.45 155.95,19.45
$1N5360: length 4.8
  Top Layer w0.2: C83.2 159.15,13.73 R57.2 158.1,11.85 C81.1
$1N5361: length 10.1
  Top Layer w0.2: C80.1 155.88,11.63 156.83,11.63 157.03,11.83 157.03,13.94 R56.2 160.64,14.71 C82.2
$1N5362: length 3
  Top Layer w0.2: C82.1 161.87,12.08 161.87,9.39
$1N5365: length 1.4
  Top Layer w0.2: 160.87,9.39 160.87,9.43 159.91,10.39
$1N5368: length 1.8
  Top Layer w0.2: U21.12 162.63,6.57 C87.1
$1N5369: length 1.3
  Top Layer w0.2: 161.87,6.57 161.87,5.54 C88.2
$1N5370: length 1.3
  Top Layer w0.2: 160.87,6.57 160.65,6.36 C88.1
$1N5382: length 1.7
  Top Layer w0.2: U21.8 158.62,7.23 158.57,7.28
$1N9109: length 19.9
  Top Layer w0.4: U21.5 159.75,9.19 v1(159.75,9.25)
  Top Layer w0.5: CN13.3 144.91,7.13 152.63,7.13 153.93,5.83 154.43,5.83 v1(155.03,5.23)
  Bottom Layer w0.5: v1(155.03,5.23) 157.43,7.63 160.13,7.63 160.43,7.93 160.43,8.58 v1(159.75,9.25)
$1N9136: length 26.8
  Top Layer w0.4: v1(163.75,8.75) 163.05,8.75 U21.16
  Top Layer w0.5: CN13.5 148.37,12.98 150.07,11.28 CN13.4 153.38,10.28 153.38,7.76 154.01,7.13 154.63,7.13 155.83,5.93 v1(155.83,4.83)
  Bottom Layer w0.5: v1(155.83,4.83) 157.9,6.89 161.9,6.89 v1(163.75,8.75)
$1N24333: length 3.5
  Top Layer w0.2: C83.1 161.37,10.88 U21.3
$1N24340: length 1.4
  Top Layer w0.2: C84.1 162.37,10.19 U21.1
$1N24601: length 4.2
  Top Layer w0.3: U22.2 150.65,17.2 150.33,17.53 150.33,19.93 C90.1
$1N24795: length 1.4
  Top Layer w0.2: 152.48,14.33 152.27,14.54 152.27,15.63
$1N24871: length 1.9
  Top Layer w0.2: C92.2 153.43,18.68 R64.1
$1N24873: length 3.8
  Top Layer w0.2: R63.2 153.18,16.13 153.18,17.19 152.52,17.85 U22.3
$1N24877: length 3
  Top Layer w0.2: R64.2 152.7,18.5 U22.4
$1N24927: length 4.2
  Top Layer w0.3: C93.1 150.13,24.43 150.55,24 U23.2
$1N25083: length 2.3
  Top Layer w0.2: R62.2 152.64,26.37 U23.4
$1N25086: length 2.6
  Top Layer w0.2: R61.2 152.73,23.97 152.73,24.23 152.3,24.65 U23.3
$1N25088: length 1.6
  Top Layer w0.2: 154.93,28.07 154.74,27.88 R62.1
$1N25090: length 1.9
  Top Layer w0.2: C94.2 154.14,24.78 R61.1

## Copper pours and planes (outline as drawn; the poured copper is in the pictures)
+1V1 on Top Layer: 12.63,56.16 13.03,56.16 13.03,58.26 12.63,58.66 10.63,58.66 10.63,61.86 13.83,61.86 14.13,62.16 14.13,64.36 13.93,64.36 13.93,63.26 13.83,63.16 13.13,63.16 13.03,63.06 13.03,62.76 12.73,62.46 10.43,62.46 10.03,62.06 10.03,58.46 10.53,57.96 12.33,57.96 12.63,57.66
+3.3V on Top Layer: 12.56,56.16 12.56,57.66 12.28,57.93 10.39,57.93 9.96,58.36 9.96,62.06 10.46,62.56 12.76,62.56 12.96,62.76 12.96,64.36 12.36,64.36 12.36,63.26 12.26,63.16 8.16,63.16 8.16,62.76 9.26,62.76 9.36,62.66 9.36,59.46 9.26,59.36 8.16,59.36 8.16,59.16 9.26,59.16 9.36,59.06 9.36,57.76 9.76,57.36 12.26,57.36 12.26,56.16
+3.3V on Top Layer: 163.95,24.26 163.15,23.46 163.15,21.65 163.25,21.55 165.85,21.55 166.15,21.85 166.15,23.61 165.86,23.91 165.3,23.91 165.15,24.05 165.15,25.07 164.9,25.33 164.23,25.33 163.95,25.05
+3.3V on Top Layer: 14.53,59.16 13.88,59.81 13.88,63.36 14.27,63.36 14.27,64.52 14.63,64.88 17.63,64.88 17.63,62.79 17.5,62.67 15.13,62.67 15.13,59.56 15.33,59.36 16.33,59.36 16.33,59.16
+3.3V on Top Layer: 163.15,17.65 163.4,17.89 165.67,17.89 165.95,17.61 165.95,15.91 165.8,15.75 163.25,15.75 163.15,15.85
+5V on Top Layer: 26.88,15.88 28.38,15.88 28.88,15.38 28.88,12.88 28.13,12.13 27.13,12.13 26.88,12.38
GND on Top Layer: -13.87,111.43 195.23,111.43 195.23,-11.67 -13.87,-11.67
GND on Top Layer: 13.83,59.81 13.83,61.86 10.63,61.86 10.63,58.66 12.83,58.66 13.13,58.36 13.13,57.36 15.12,57.36 15.12,59.06
GND on Bottom Layer: -22.77,112.33 197.63,112.33 197.63,-23.17 -22.77,-23.17
GND on Inner1: -29.07,114.53 200.53,114.53 200.53,-30.17 -29.07,-30.17
GND on Inner2: -35.67,119.83 209.03,119.83 209.03,-29.77 -35.67,-29.77
VBUS on Top Layer: 27.45,10.74 27.45,8.34 25.2,6.09 22.7,6.09 22.41,6.39 22.41,7.39 22,7.79 20.01,7.79 20.01,6.69 19.3,6.69 19.3,8.69 19.73,9.12 19.73,11.05 19.88,11.21 21.45,11.21 21.69,10.97 21.69,9.31 21.8,9.19 24.7,9.19 24.8,9.29 26.3,9.29 26.7,9.69 26.7,10.79 26.91,10.99 27.2,10.99
VBUS on Top Layer: 15.2,6.79 15.2,8.89 14.5,9.59 13.3,9.59 13.3,10.79 13.11,10.99 11.75,10.99 11.41,10.65 11.41,9.39 11,8.99 9.91,8.99 9.2,8.29 9.2,5.89 9.5,5.59 11.5,5.59 12.2,6.29 12.2,7.03 13.37,8.19 14.53,8.19 14.53,6.77 15.19,6.77

## Text on the board
Top Silkscreen Layer: Please don't kill me Nintendo | PROTOTYPE_PROTOTYPE_PROTOTYPE
